# EAGLE design OPNpool r3 (EAGLE 9.6.2)
REV: 0.1
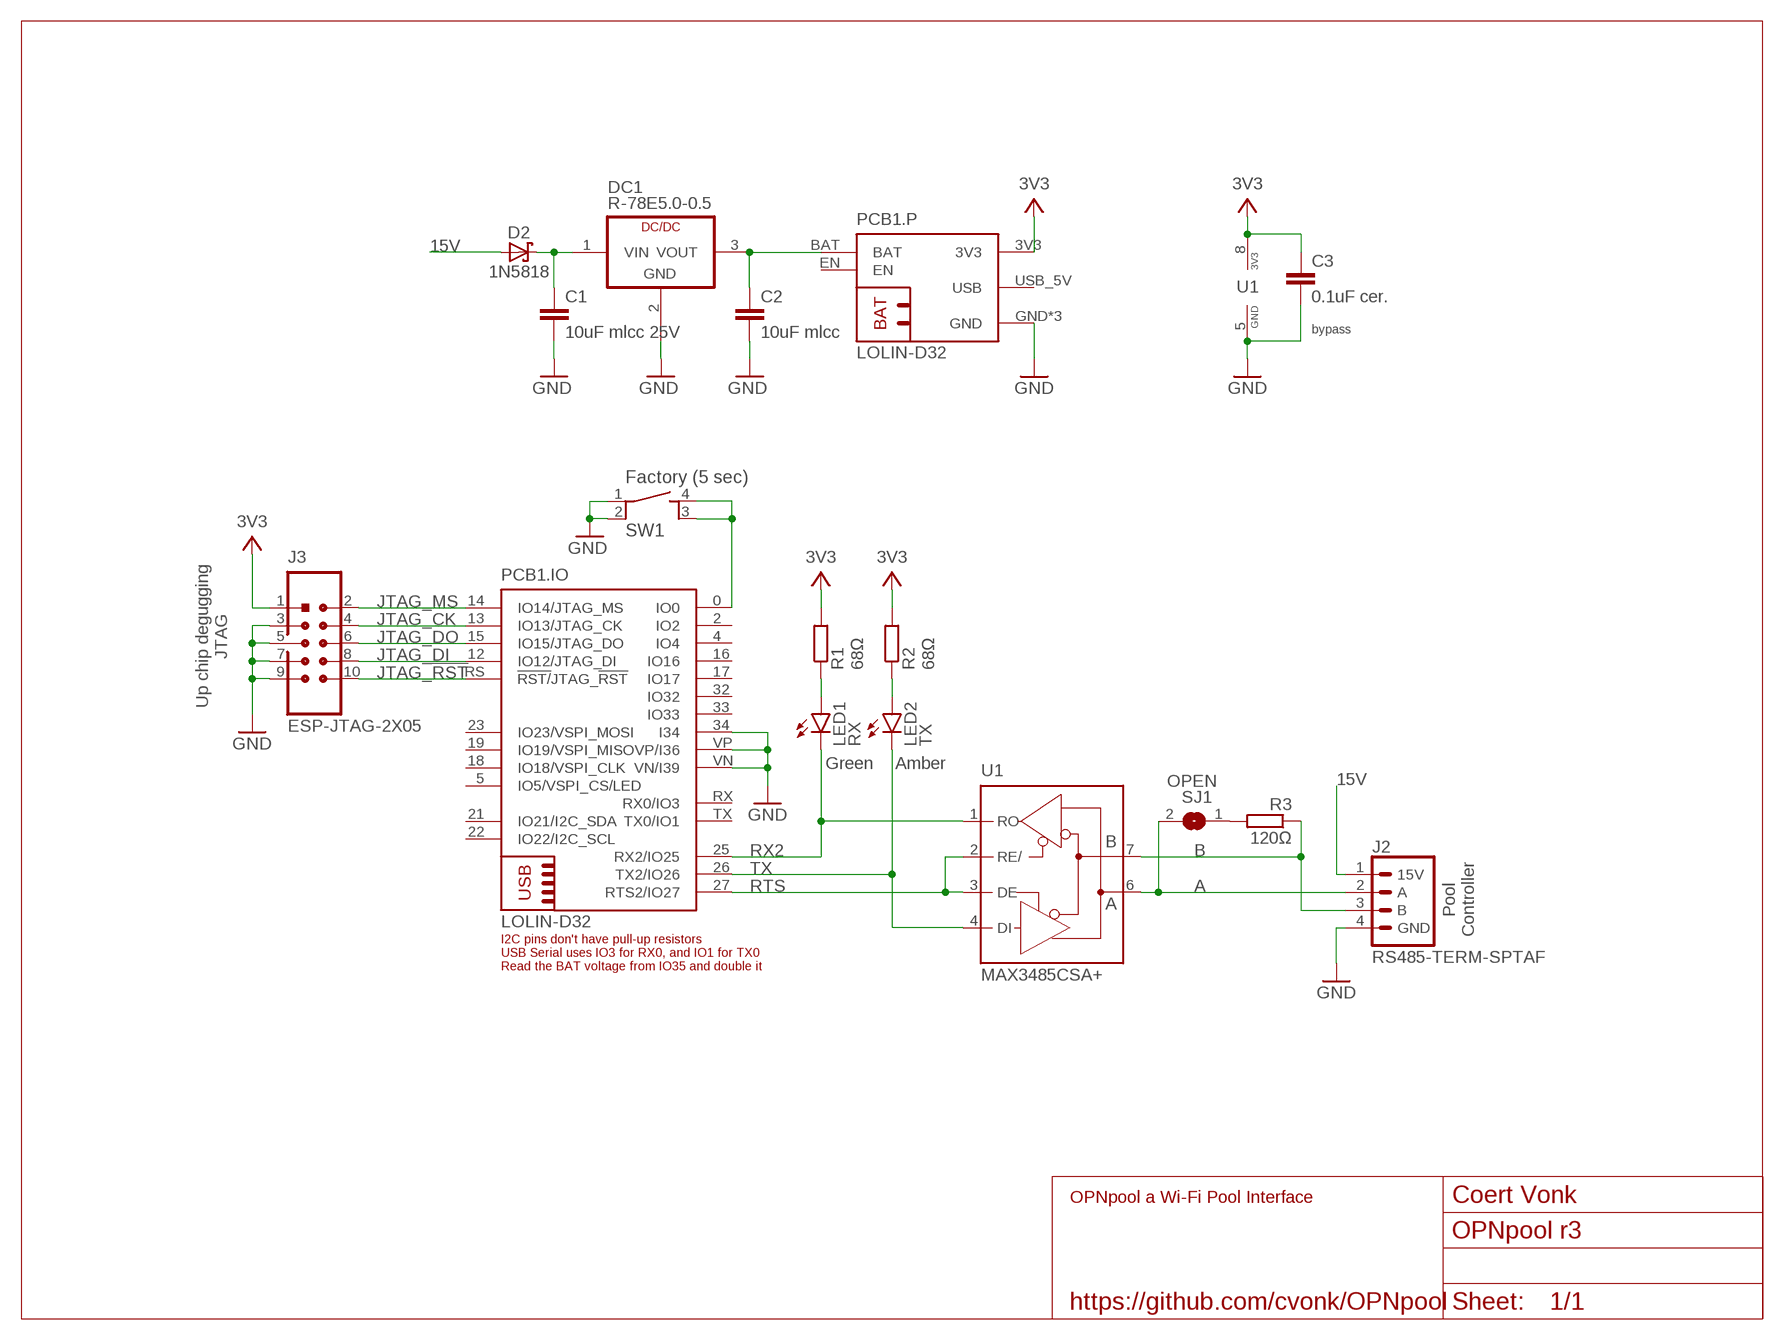
[diagram p0: schematic, sheet 1]
U$1 (FRAME_LETTER_L): AUTHOR_NAME: Coert Vonk; DESCRIPTION: OPNpool a Wi-Fi Pool Interface; REV: 1.1; URL: https://github.com/cvonk/OPNpool

## Parts
C1  10uF mlcc 25V  C-EUC0805K  [C0805K]
C2  10uF mlcc  C-EUC0805K  [C0805K]
C3  0.1uF cer.  C-EUC0805K  [C0805K]
D2  1N5818  [DO41-7.6]
DC1  R-78E5.0-0.5  [SIP3]
J2  RS485-TERM-SPTAF  [SPTAF1/4-5,0-LL]
J3  ESP-JTAG-2X05  [2X05_SHROUDED]
LED1  RX  LEDCHIPLED_0805  [CHIPLED_0805]
LED2  TX  LEDCHIPLED_0805  [CHIPLED_0805]
PCB1  LOLIN-D32  [LOLIN-D32]
R1  68Ω  R-EU_R0805  [R0805]
R2  68Ω  R-EU_R0805  [R0805]
R3  120Ω  R-EU_R0805  [R0805]
SJ1  OPEN  SJ  [SJ]
SW1  Factory (5 sec)  1-1825910-4  [TE_1-1825910-4]
U1  MAX3485CSA+  [SO08]

## Nets
3V3: C3.1 J3.1(3V3) PCB1.3V3(.P:3V3) R1.2 R2.2 U1.8(P:VCC)
15V: D2.A J2.1(15V)
A: J2.2(A) SJ1.2 U1.6(A)
B: J2.3(B) R3.1 U1.7(B)
GND: C1.2 C2.2 C3.2 DC1.2(GND) J2.4(GND) J3.3(GND) J3.5(GND) J3.7(GND) J3.9(GND) PCB1.34(.IO:I34) PCB1.GND(.P:GND) PCB1.GND@1(.P:GND) PCB1.GND@2(.P:GND) PCB1.VN(.IO:VN/I39) PCB1.VP(.IO:VP/I36) SW1.1 SW1.2 U1.5(P:GND)
JTAG_!RST: J3.10(NC) PCB1.RS(.IO:!RST/!JTAG_!RST)
JTAG_CK: J3.4(TCK) PCB1.13(.IO:IO13/JTAG_CK)
JTAG_DI: J3.8(TDI) PCB1.12(.IO:IO12/JTAG_DI)
JTAG_DO: J3.6(TDO) PCB1.15(.IO:IO15/JTAG_DO)
JTAG_MS: J3.2(TMS) PCB1.14(.IO:IO14/JTAG_MS)
N$1: LED1.A R1.1
N$2: LED2.A R2.1
N$3: PCB1.0(.IO:IO0) SW1.3 SW1.4
N$5: R3.2 SJ1.1
RTS: PCB1.27(.IO:RTS2/IO27) U1.2(RE/) U1.3(DE)
RX2: LED1.C PCB1.25(.IO:RX2/IO25) U1.1(RO)
TX: LED2.C PCB1.26(.IO:TX2/IO26) U1.4(DI)
VIN: C1.1 D2.C DC1.1(VIN)
VOUT: C2.1 DC1.3(VOUT) PCB1.BAT(.P:BAT)
Unconnected: PCB1.2(.IO:IO2) PCB1.4(.IO:IO4) PCB1.5(.IO:IO5/VSPI_CS/LED) PCB1.16(.IO:IO16) PCB1.17(.IO:IO17) PCB1.18(.IO:IO18/VSPI_CLK) PCB1.19(.IO:IO19/VSPI_MISO) PCB1.21(.IO:IO21/I2C_SDA) PCB1.22(.IO:IO22/I2C_SCL) PCB1.23(.IO:IO23/VSPI_MOSI) PCB1.32(.IO:IO32) PCB1.33(.IO:IO33) PCB1.EN(.P:EN) PCB1.RX(.IO:RX0/IO3) PCB1.TX(.IO:TX0/IO1) PCB1.USB_5V(.P:USB)

## Notes on the sheet
- bypass
- Up chip degugging
  JTAG
- Green | Amber
- Pool
  Controller

## Library data of the parts
C1 C2 = rcl:C-EU: CAPACITOR, European symbol; MANF: Murata Electronics; MANF#: GJ821BR61E106KE11L; MOUSER#: 81-GJ821BR61E106KE1L; SPICEPREFIX: C
C3 = rcl:C-EU: CAPACITOR, European symbol; MANF: KEMET; MANF#: C0805C104K1RECAUTO; MOUSER#: 80-C0805C104K1REAUTO; SPICEPREFIX: C
D2 = Coert Vonk:1N581*: 1.0A SCHOTTKY BARRIER RECTIFIER Source: http://www.diodes.com/datasheets/ds23001.pdf; MANF: Rectron; MANF#: 1N5818-T; MOUSER#: 583-1N5818-T
DC1 = Coert Vonk:R-78E*-0.5: DC/DC-Converter 5V 500 mA Technical specifications: Manufacturer: Recom Input Voltage: 7 - 28 V Output Voltage: 5 V Output Current: 500 mA Mfr.: R-78E5.0-0.5, data sheet <http://www.recom-power.com/pdf/Innoline/R-78Exx-0.5.pdf> Mouser: 919-R-78E5.0-0.5, abt. $2.70; MANF: RECOM Power; MANF#: R-78E5.0-0.5; MOUSER#: 919-R-78E5.0-0.5
J2 = Coert Vonk:RS485-TERM: SPTAF 1/ 4-5,0-LL - 1864451, PCB push terminal block Technical specifications: Manufacturer: Phoenix Contact Current Rating: 13.5 A Voltage Rating: 320 V Wire Gauge Range: 24 AWG to 18 AWG Mfr.#: 1864451 Mouser: 651-1864451, abt. $1.85; MANF: Phoenix Contact; MANF#: 1864451; MOUSER#: 651-1864451
J3 = Coert Vonk:ESP-JTAG: 10-pin JTAG Header, shrouded header, 2-row, 2.54 pitch Specifications: Manufacturer: Molex Voltage rating: 250 VDC Current rating: 2.5 A Operating temperature: -55 - 120 C Mfr.#: 70246-1004 Mouser #: 538-70246-1004, about $1.19, data sheet <https://www.mouser.com/datasheet/2/276/0702461004_PCB_HEADERS-229930.pdf>; DIGIKEY#: WM3478-ND; MANF: Molex; MANF#: 70246-1004; MOUSER#: 538-70246-1004
LED1 LED2 = OPNpool:LED: LED OSRAM: - CHIPLED LG R971, LG N971, LY N971, LG Q971, LY Q971, LO R971, LY R971 LH N974, LH R974 LS Q976, LO Q976, LY Q976 LO Q996 - Hyper CHIPLED LW Q18S LB Q993, LB Q99A, LB R99A - SideLED LS A670, LO A670, LY A670, LG A670, LP A670 LB A673, LV A673, LT A673, LW A673 LH A674 LY A675 LS A676, LA A676, LO A676, LY A676, LW A676 LS A679, LY A679, LG A679 - Hyper Micro SIDELED® LS Y876, LA Y876, LO Y876, LY Y876 LT Y87S - SmartLED LW L88C, LW L88S LB L89C, LB L89S, LG L890 LS L89K, LO L89K, LY L89K LS L896, LA L896, LO L896, LY L896 - TOPLED LS T670, LO T670, LY T670, LG T670, LP T670 LSG T670, LSP T670, LSY T670, LOP T670, LYG T670 LG T671, LOG T671, LSG T671 LB T673, LV T673, LT T673, LW T673 LH T674 LS T676, LA T676, LO T676, LY T676, LB T676, LH T676, LSB T676, LW T676 LB T67C, LV T67C, LT T67C, LS T67K, LO T67K, LY T67K, LW E67C LS E67B, LA E67B, LO E67B, LY E67B, LB E67C, LV E67C, LT E67C LW T67C LS T679, LY T679, LG T679 LS T770, LO T770, LY T770, LG T770, LP T770 LB T773, LV T773, LT T773, LW T773 LH T774 LS E675, LA E675, LY E675, LS T675 LS T776, LA T776, LO T776, LY T776, LB T776 LHGB T686 LT T68C, LB T68C - Hyper Mini TOPLED® LB M676 - Mini TOPLED Santana® LG M470 LS M47K, LO M47K, LY M47K Source: http://www.osram.convergy.de LUXEON: - LUMILED® LXK2-PW12-R00, LXK2-PW12-S00, LXK2-PW14-U00, LXK2-PW14-V00 LXK2-PM12-R00, LXK2-PM12-S00, LXK2-PM14-U00 LXK2-PE12-Q00, LXK2-PE12-R00, LXK2-PE12-S00, LXK2-PE14-T00, LXK2-PE14-U00 LXK2-PB12-K00, LXK2-PB12-L00, LXK2-PB12-M00, LXK2-PB14-N00, LXK2-PB14-P00, LXK2-PB14-Q00 LXK2-PR12-L00, LXK2-PR12-M00, LXK2-PR14-Q00, LXK2-PR14-R00 LXK2-PD12-Q00, LXK2-PD12-R00, LXK2-PD12-S00 LXK2-PH12-R00, LXK2-PH12-S00 LXK2-PL12-P00, LXK2-PL12-Q00, LXK2-PL12-R00 Source: www.luxeon.com KINGBRIGHT: KA-3528ASYC Source: www.kingbright.com
PCB1 = Coert-Vonk:LOLIN-D32: Footprint of Wemos LOLIN D32 (ESP-WROOM-32) Technical specifications: Manufacturer: Wemos SoC: ESP32-WROOM-32, 4 MByte flash, max 240MHz Optional battery: 3.7V Lipo, connector PH-2(2.0mm) UART: CH340, micro-USB connector Mfr.#: LOLIN D32, data sheet <https://wiki.wemos.cc/products:d32:d32> Alibaba: 32808551116, about $6.50
R1-R3 = rcl:R-EU_: RESISTOR, European symbol; MANF: Bourns; MANF#: CRM0805-JW-1R5ELF; MOUSER#: 652-CRM0805JW1R5ELF; SPICEPREFIX: R
SJ1 = jumper:SJ: SMD solder JUMPER
SW1 = 1-1825910-4:1-1825910-4: Switch Tactile OFF (ON) SPST Round Button PC Pins 0.05A 24VDC 100000Cycles 1.56N Thru-Hole Loose; COMMENT: 1-1825910-4; DESCRIPTION: Switch Tactile OFF (ON) SPST Round Button PC Pins 0.05A 24VDC 100000Cycles 1.56N Thru-Hole; DIGI-KEY_PART_NUMBER: 450-1653-ND; MF: TE Connectivity; MP: 1-1825910-4; PACKAGE: None; PURCHASE-URL: https://pricing.snapeda.com/search/part/1-1825910-4/?ref=eda
U1 = Coert Vonk:MAX3485CSA+: RS-485 Transceiver 3.3V SMD Technical specifications: Manufacturer: Maxim Integrated Operating supply: 3.3 V, 1.1 mA Output: 3 V, 20 mA Data rate: 10 Mb/s Temperature range: 0 - 70 C Mfr.: R-78E5.0-0.5 Mouser: 919-R-78E5.0-0.5, abt. $2.70, details <https://www.mouser.com/ProductDetail/Maxim-Integrated/MAX3485CSA%2b>; MANF: Maxim Integrated; MANF#: MAX3485CSA+; MF: MAXIM; MOUSER#: 700-MAX3485CSA; MPN: MAX481CSA; OC_FARNELL: unknown; OC_NEWARK: 90C3817

## Board
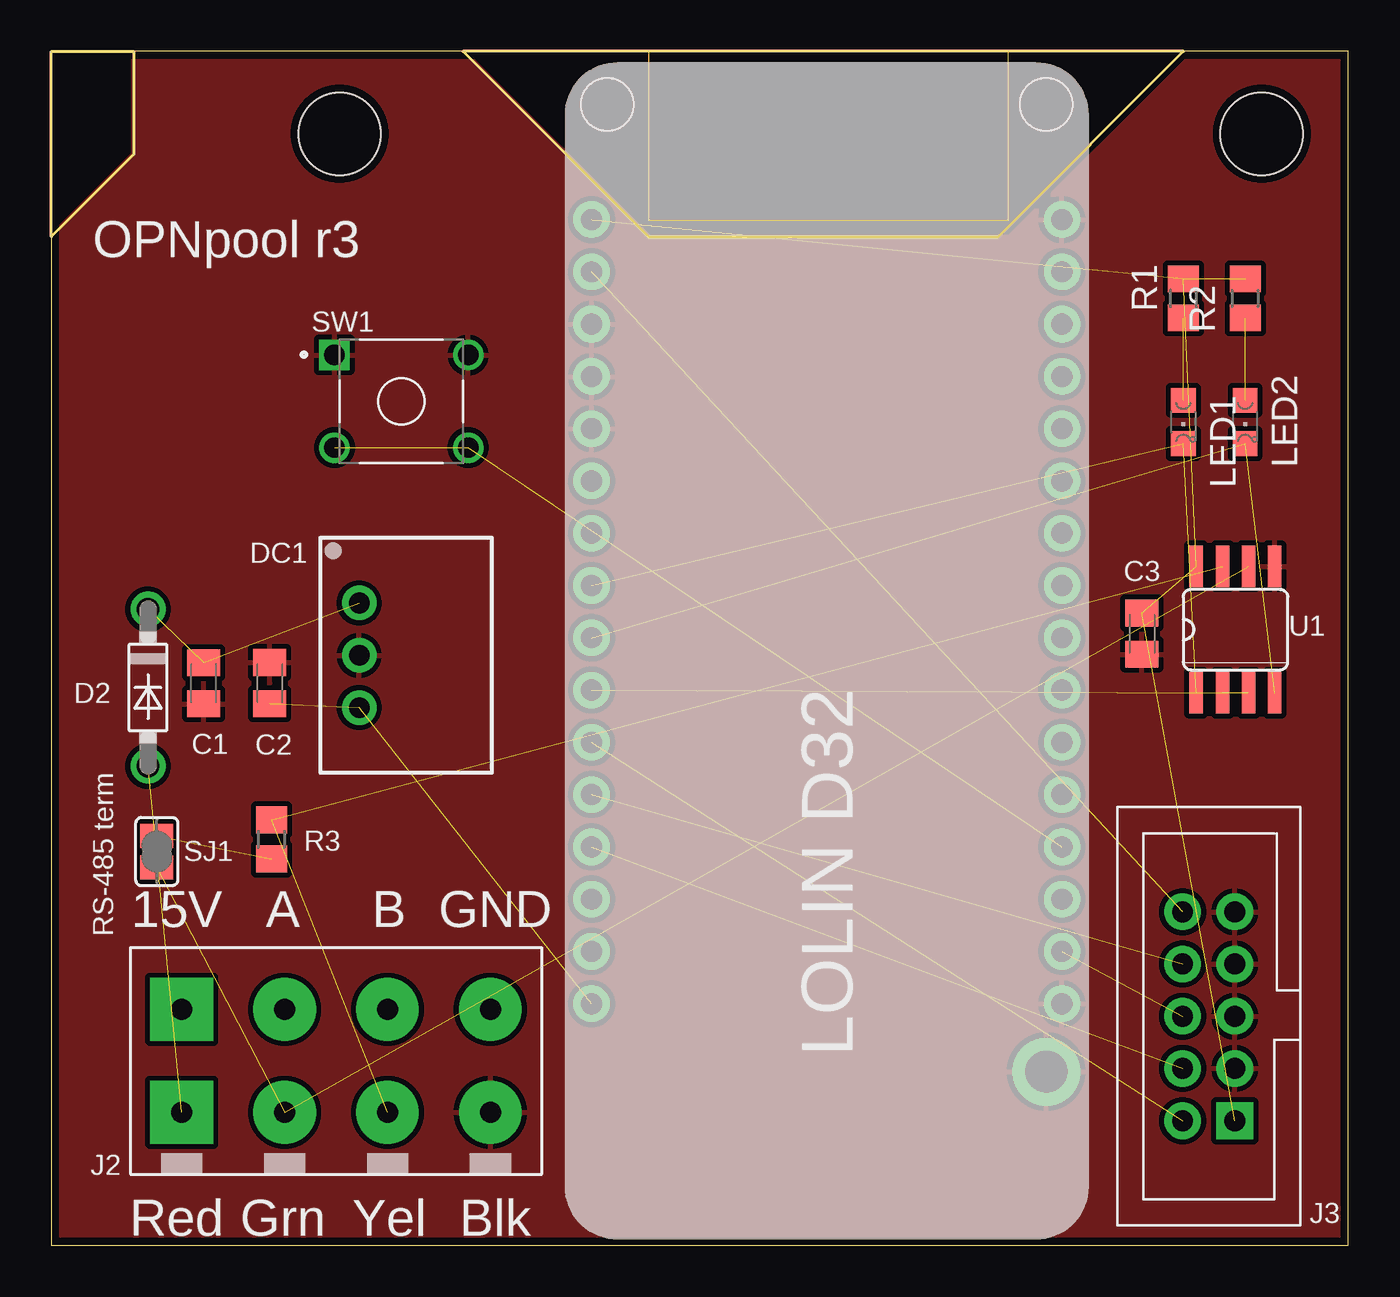
[diagram p1: board, top side]
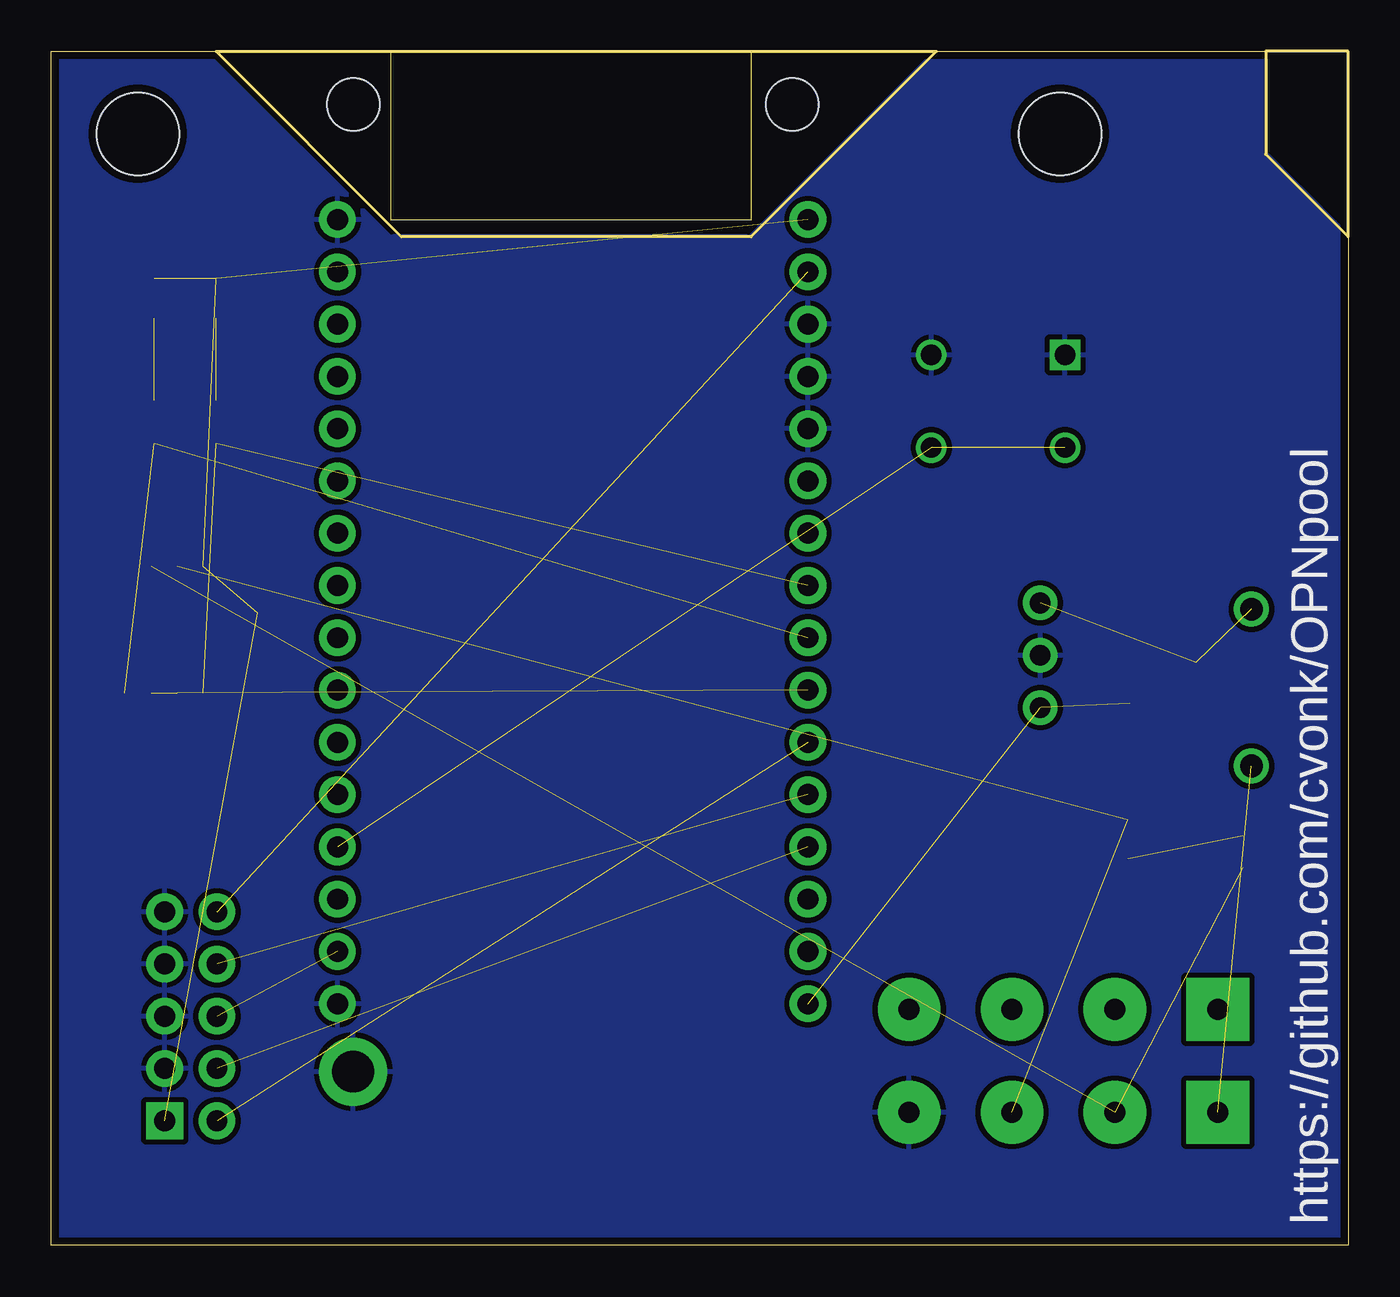
[diagram p2: board, bottom side, seen from below]

Size 63 x 58 mm. Coordinates in mm from the lower left corner, seen from the top.
Outline: 0,58 0,0 63,0 63,58 0,58
Copper layers (1*16): Top 0.035559375mm / dielectric 1.6mm / Bottom 0.035559375mm
Design rules "oshpark-2layer-auto-routing": minimum track width 10mil, minimum drill 10mil, track to track 10mil, track to pad 8mil, pad to pad 8mil, via to via 8mil, smd to smd 6mil, copper to edge 15mil, drill to drill 6mil, minimum pad ring 6mil, minimum via ring 6mil, stop-mask expansion 2.5mil, vias tented up to drill 0mil, thermal gap 10mil
Holes 4 mm at 14,54 58.8,54
tRestrict: area 29,50 to 47,58
bRestrict: area 29,50 to 47,58
Milling: area 29,49.8 to 46.5,58; 8 lines

### Footprints (pad centres in the part's own frame; a part is rotated, then mirrored left to right if it is on the bottom)
C0805K = smd 1.3 x 1.6: 1 -1,0; 2 1,0
DO41-7.6 = drill 1.1 pad 1.7: A 3.81,0; C -3.81,0
SIP3 = drill 1 pad 1.676: 1 -2.54,-2.54; 2 0,-2.54; 3 2.54,-2.54
SPTAF1/4-5,0-LL = drill 1.016 pad 3.048 square: 1 -7.713,-2.54; 1@1 -7.713,2.46 | drill 1.016 pad 3.048: 2 -2.713,-2.54; 2@1 -2.713,2.46; 3 2.287,-2.54; 3@1 2.287,2.46; 4 7.287,-2.54; 4@1 7.287,2.46
2X05_SHROUDED = drill 1.016 pad 1.778 square: 1 -5.08,-1.27 | drill 1.016 pad 1.778: 2 -5.08,1.27; 3 -2.54,-1.27; 4 -2.54,1.27; 5 0,-1.27; 6 0,1.27; 7 2.54,-1.27; 8 2.54,1.27; 9 5.08,-1.27; 10 5.08,1.27
CHIPLED_0805 = smd 1.2 x 1.2: A 0,-1.05; C 0,1.05
LOLIN-D32 = drill 1.016 pad 1.778: 0 -10.16,-10.16; 2 -12.7,-10.16; 3V3 20.32,12.7; 4 -7.62,-10.16; 5 0,-10.16; 12 -7.62,12.7; 13 -10.16,12.7; 14 -5.08,12.7; 15 -15.24,-10.16; 16 -5.08,-10.16; 17 -2.54,-10.16; 18 2.54,-10.16; 19 5.08,-10.16; 21 7.62,-10.16; 22 15.24,-10.16; 23 17.78,-10.16; 25 2.54,12.7; 26 0,12.7; 27 -2.54,12.7; 32 7.62,12.7; 33 5.08,12.7; 34 10.16,12.7; BAT -17.78,12.7; EN -12.7,12.7; GND -17.78,-10.16; GND@1 20.32,-10.16; RS 17.78,12.7; RX 10.16,-10.16; TX 12.7,-10.16; USB_5V -15.24,12.7; VN 12.7,12.7; VP 15.24,12.7 | drill 2.032 pad 3.302: GND@2 -21.082,-9.398 | hole 2.54: 25.908,11.938; 25.908,-9.398
R0805 = smd 1.3 x 1.5: 1 -0.95,0; 2 0.95,0
SJ = smd 1.168 x 1.6: 1 -0.762,0; 2 0.762,0
TE_1-1825910-4 = drill 0.99 square: 1 -3.25,2.25 | drill 0.99: 2 3.25,2.25; 3 -3.25,-2.25; 4 3.25,-2.25
SO08 = smd 0.66 x 2.032: 1 -1.905,-3.073; 2 -0.635,-3.073; 3 0.635,-3.073; 4 1.905,-3.073; 5 1.905,3.073; 6 0.635,3.073; 7 -0.635,3.073; 8 -1.905,3.073

### Placement (x,y rotation side)
C1  7.39,27.3 270 top
C2  10.61,27.31 90 top
C3  52.99,29.71 270 top
D2  4.69,27.09 270 top
DC1  17.5,28.66 270 top
J2  14.04,8.99 0 top
J3  56.23,11.12 90 top
LED1  55,40 180 top
LED2  58,40 180 top
PCB1  38.94,29.51 90 top
R1  55,46 90 top
R2  58,46 90 top
R3  10.69,19.71 270 top
SJ1  5.12,19.12 270 top
SW1  17,41 0 top
U1  57.53,29.91 0 top

### Tracks (layer width: path | path; a pad name or v marks a point on that pad's centre or on a via)
3V3  (5 unrouted)
15V  (1 unrouted)
A  (2 unrouted)
B  (2 unrouted)
GND
  pour Top: 0,0 0,49 4,53 4,58 20,58 29.1,48.9 29.2,49 46.4,49 46.5,48.9 55.4,57.8 55.4,58 63,58 63,0
  pour Bottom: 0,0 0,49 4,53 4,58 20,58 29.1,48.9 29.2,49 46.4,49 46.5,48.9 55.4,57.8 55.4,58 63,58 63,0
  pour Top: 0,0 0,49 4,53 4,58 20,58 29.1,48.9 29.2,49 46.4,49 46.5,48.9 55.4,57.8 63.15,57.8 63.15,0
JTAG_!RST  (1 unrouted)
JTAG_CK  (1 unrouted)
JTAG_DI  (1 unrouted)
JTAG_DO  (1 unrouted)
JTAG_MS  (1 unrouted)
N$1  (1 unrouted)
N$2  (1 unrouted)
N$3  (2 unrouted)
N$5  (1 unrouted)
RTS  (2 unrouted)
RX2  (2 unrouted)
TX  (2 unrouted)
VIN  (2 unrouted)
VOUT  (2 unrouted)

### Text on the board
tNames: OPNpool r3 | RS-485 term
bNames: https://github.com/cvonk/OPNpool